# Altium schematic sheet ShieldConnections.SchDoc: Connectors for MSP430 Shield
size A4; DocumentNumber: 2; SheetNumber: 2; SheetTotal: 2
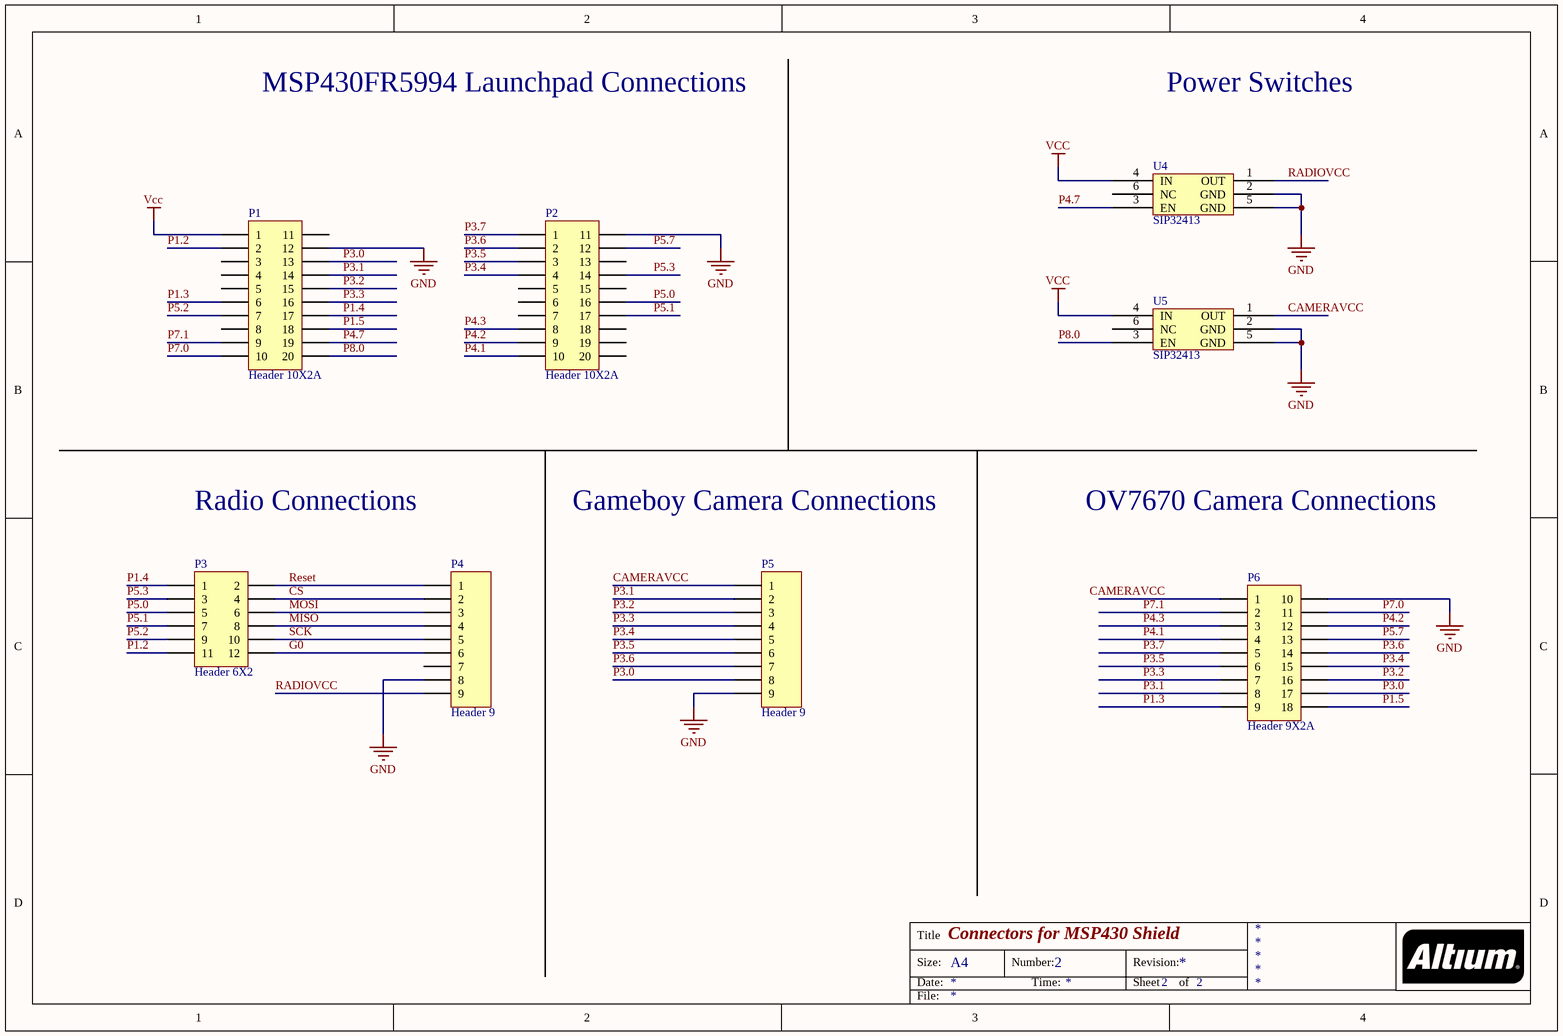
[diagram p0: ShieldConnections.SchDoc]

## Parts
P1  Header 10X2A  [HDR2X10_CEN]
P2  Header 10X2A  [HDR2X10_CEN]
P3  Header 6X2  [HDR2X6]
P4  Header 9  [HDR1X9]
P5  Header 9  [HDR1X9]
P6  Header 9X2A  [HDR2X9_CEN]
U4  SIP32413  [SC70-6]
U5  SIP32413  [SC70-6]

## Nets
GND: P1.12 P2.11 P4.8 P5.9 P6.10 U4.2(GND) U4.5(GND) U5.2(GND) U5.5(GND)
Vcc: P1.1 U4.4(IN) U5.4(IN)
CAMERAVCC: P5.1 P6.1 U5.1(OUT)
CS: P3.4 P4.2
G0: P3.12 P4.6
MISO: P3.8 P4.4
MOSI: P3.6 P4.3
P1.2: P1.2 P3.11
P1.3: P1.6 P6.9
P1.4: P1.17 P3.1
P1.5: P1.18 P6.18
P3.0: P1.13 P5.8 P6.17
P3.1: P1.14 P5.2 P6.8
P3.2: P1.15 P5.3 P6.16
P3.3: P1.16 P5.4 P6.7
P3.4: P2.4 P5.5 P6.15
P3.5: P2.3 P5.6 P6.6
P3.6: P2.2 P5.7 P6.14
P3.7: P2.1 P6.5
P4.1: P2.10 P6.4
P4.2: P2.9 P6.12
P4.3: P2.8 P6.3
P4.7: P1.19 U4.3(EN)
P5.0: P2.16 P3.5
P5.1: P2.17 P3.7
P5.2: P1.7 P3.9
P5.3: P2.14 P3.3
P5.7: P2.12 P6.13
P7.0: P1.10 P6.11
P7.1: P1.9 P6.2
P8.0: P1.20 U5.3(EN)
RADIOVCC: P4.9 U4.1(OUT)
Reset: P3.2 P4.1
SCK: P3.10 P4.5

Not connected (* = marked no-connect by the designer): P1 3 4 5 8 11; P2 5 6 7 13 15 18 19 20; P4 7; U4 6(NC); U5 6(NC)

## Notes on the sheet
- MSP430FR5994 Launchpad Connections
- Power Switches
- Radio Connections
- Gameboy Camera Connections
- OV7670 Camera Connections
- Title
- Size:
- Date:
- A4
- Number:
- Time:
- Revision:
- Sheet
- of
- File:

## Library data of the parts
P1 P2 = Header 10X2A: Header, 10-Pin, Dual row; LatestRevisionDate: 17-Jul-2002; LatestRevisionNote: Re-released for DXP Platform.; Publisher: Altium Limited
P3 = Header 6X2: Header, 6-Pin, Dual row; LatestRevisionDate: 17-Jul-2002; LatestRevisionNote: Re-released for DXP Platform.; Publisher: Altium Limited
P4 P5 = Header 9: Header, 9-Pin; LatestRevisionDate: 17-Jul-2002; LatestRevisionNote: Re-released for DXP Platform.; Publisher: Altium Limited
P6 = Header 9X2A: Header, 9-Pin, Dual row; LatestRevisionDate: 17-Jul-2002; LatestRevisionNote: Re-released for DXP Platform.; Publisher: Altium Limited
U4 U5 = SIP32431